# EasyEDA Pro project stm32_无人机.eprj, schematic 遥控器

## Sheets
1 MCU: Board Name: Board2; Create Date: 2025-11-27; Page Name: MCU; Project Name: stm32_无人机; Schematic Name: 遥控器; Update Date: 2025-11-27; Company: 嘉立创EDA; Page Size: A4; Version: V1.0
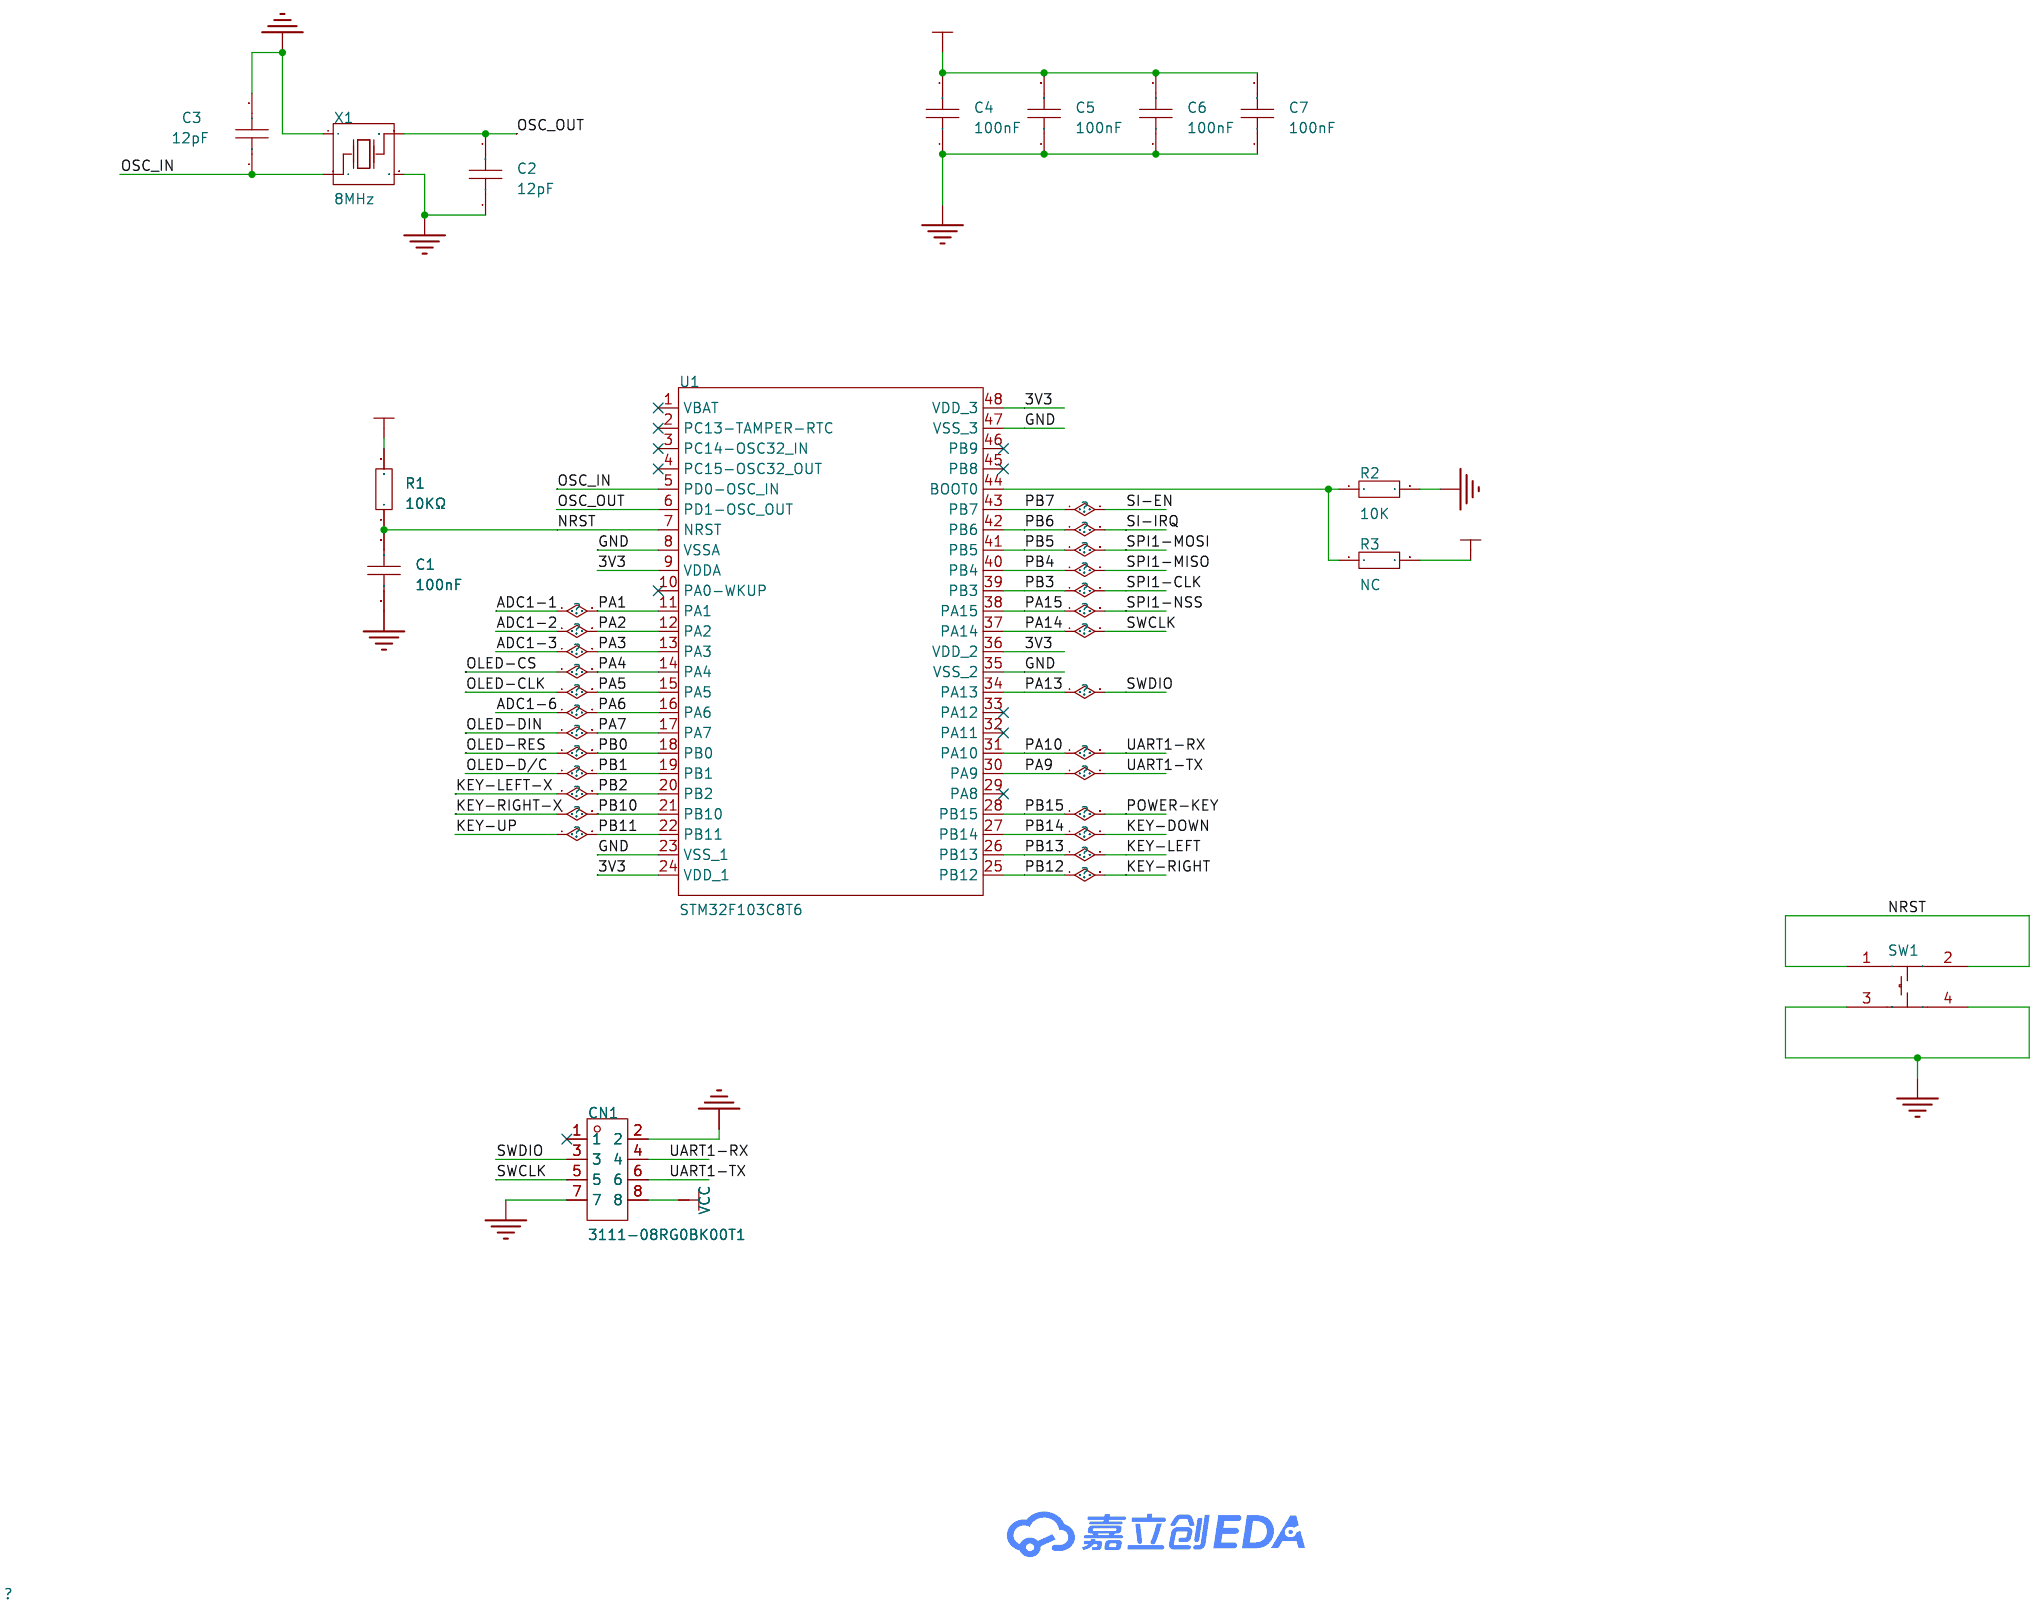
[diagram p6: MCU]
2 电源充电管理: Page Name: 电源充电管理
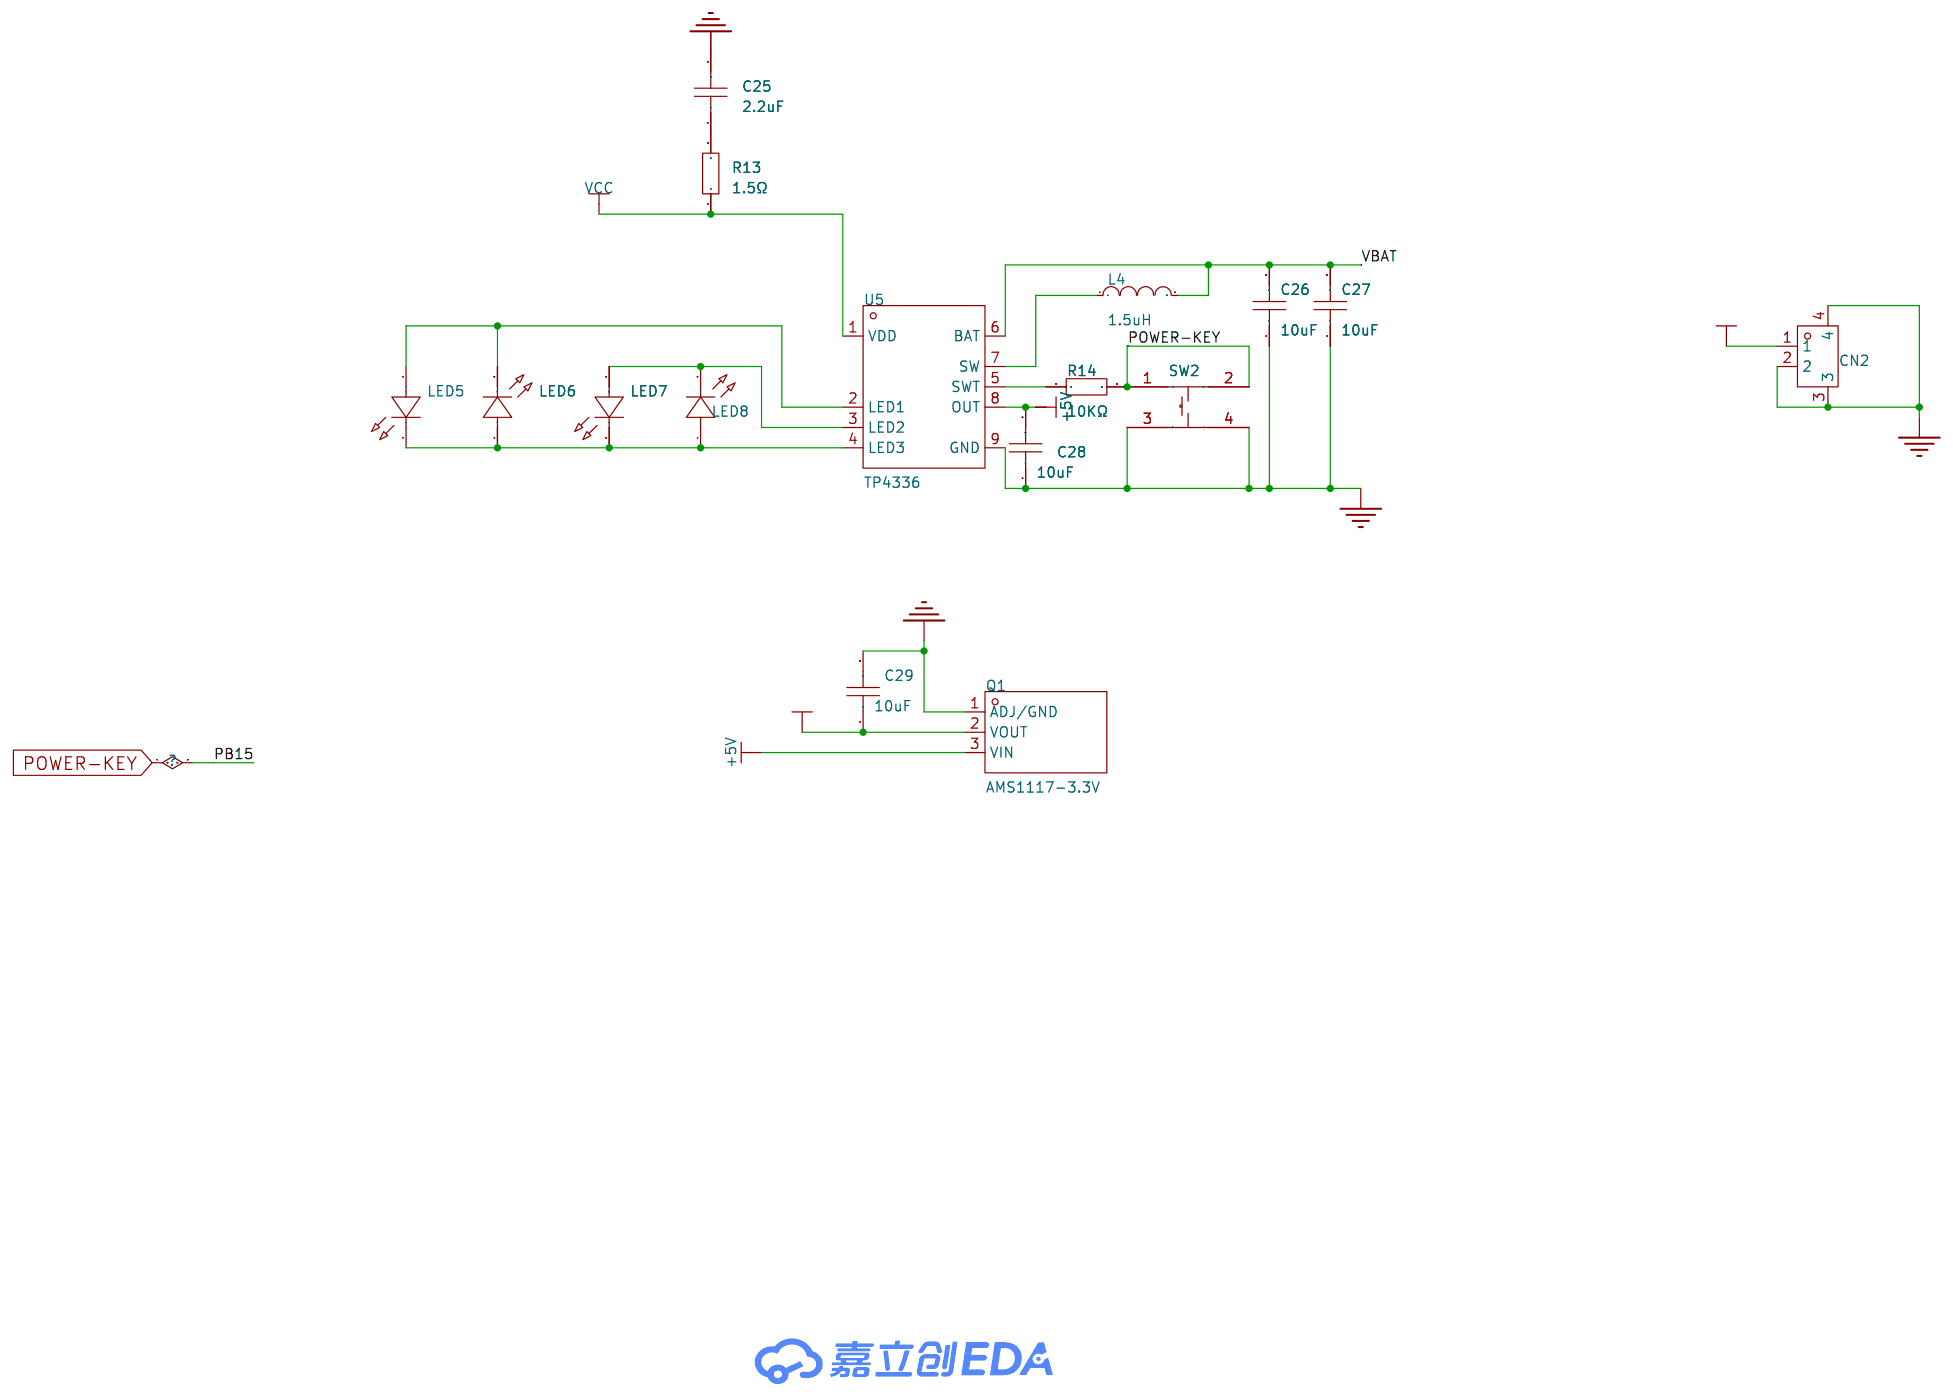
[diagram p7: 电源充电管理]
3 SI24R1: Page Name: SI24R1
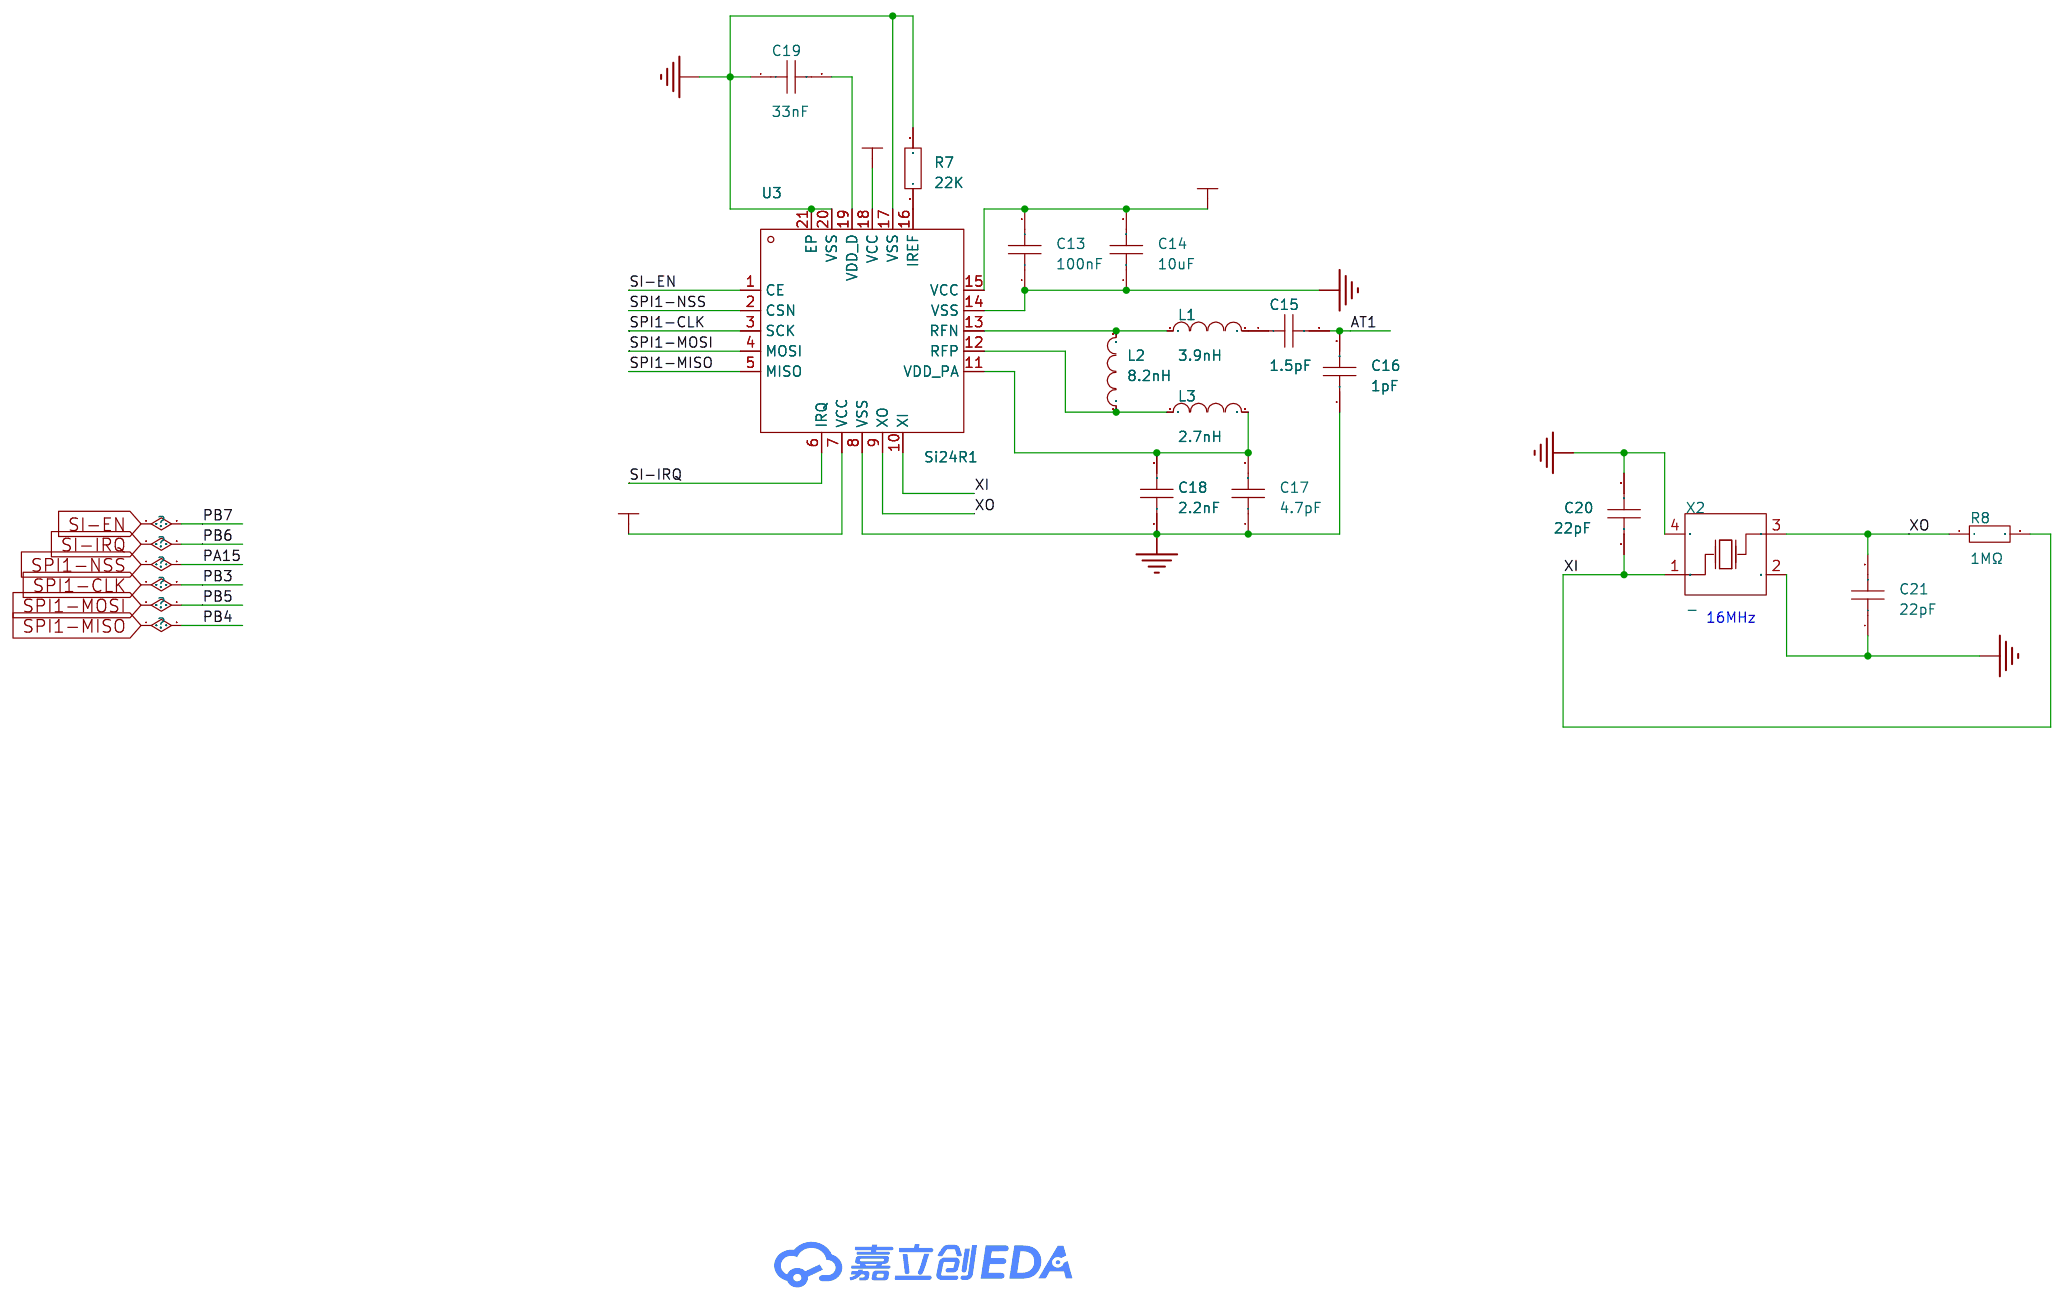
[diagram p8: SI24R1]
4 OLED: Page Name: OLED
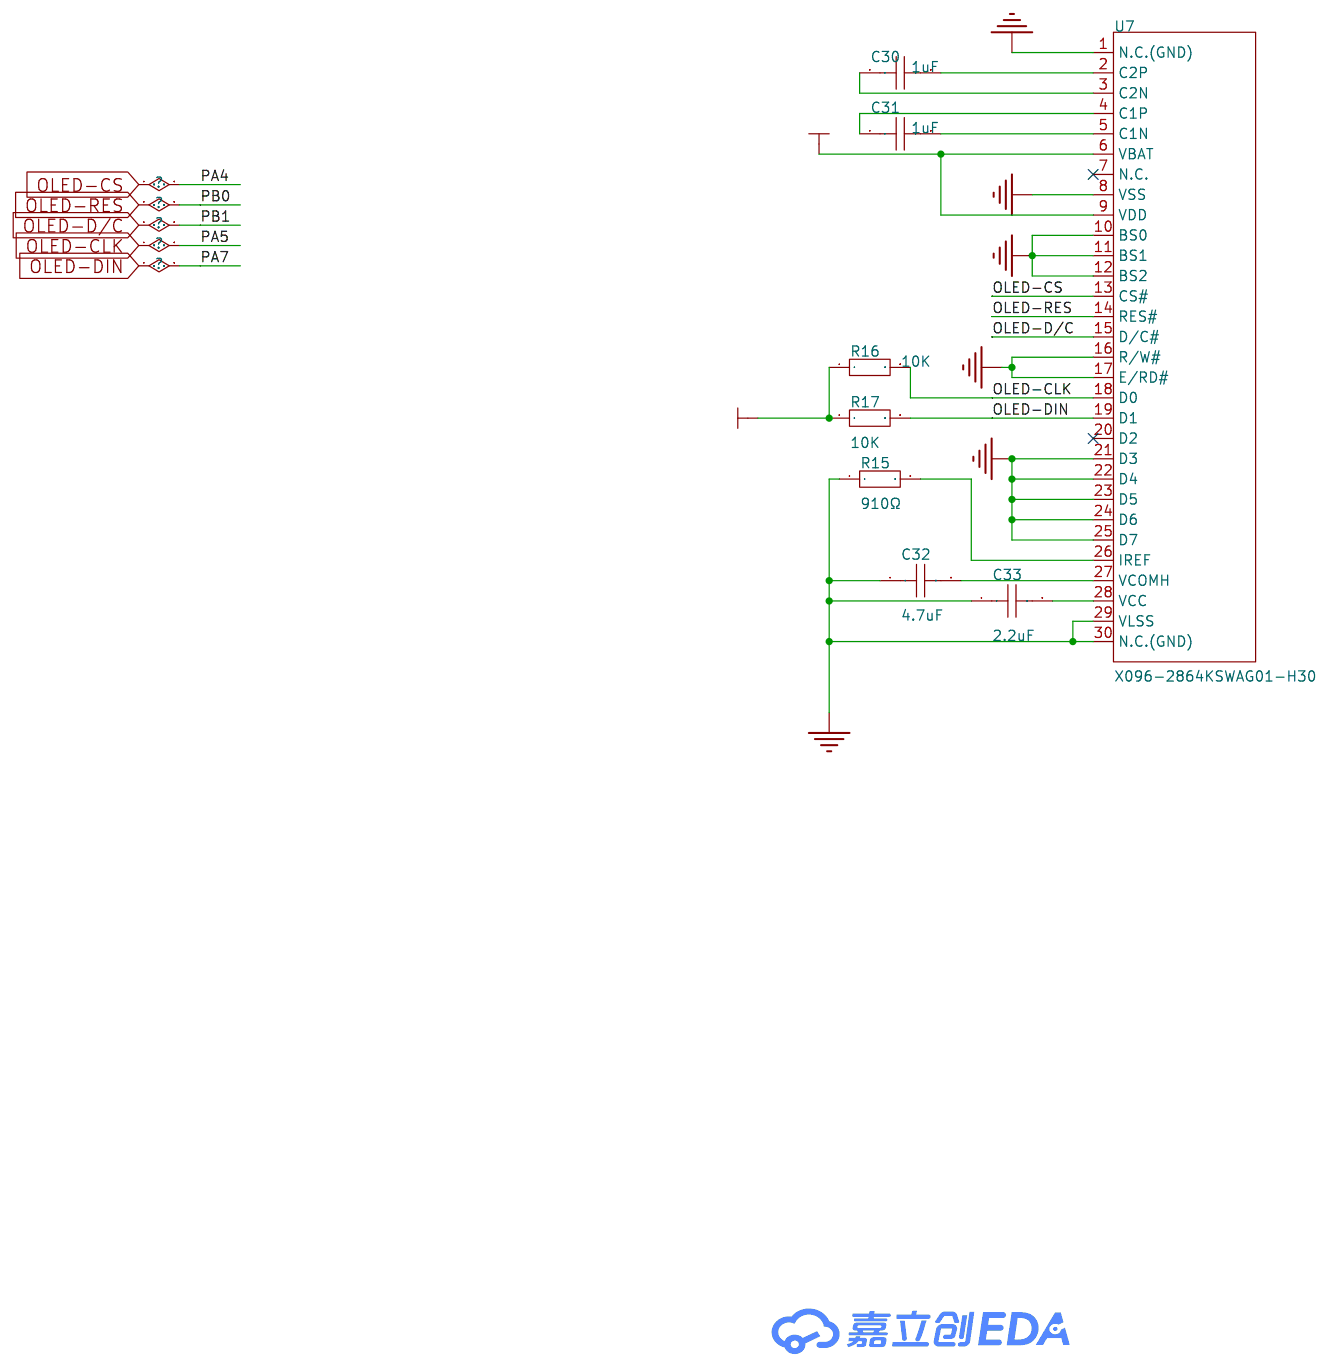
[diagram p9: OLED]
5 摇杆和按键: Page Name: 摇杆和按键
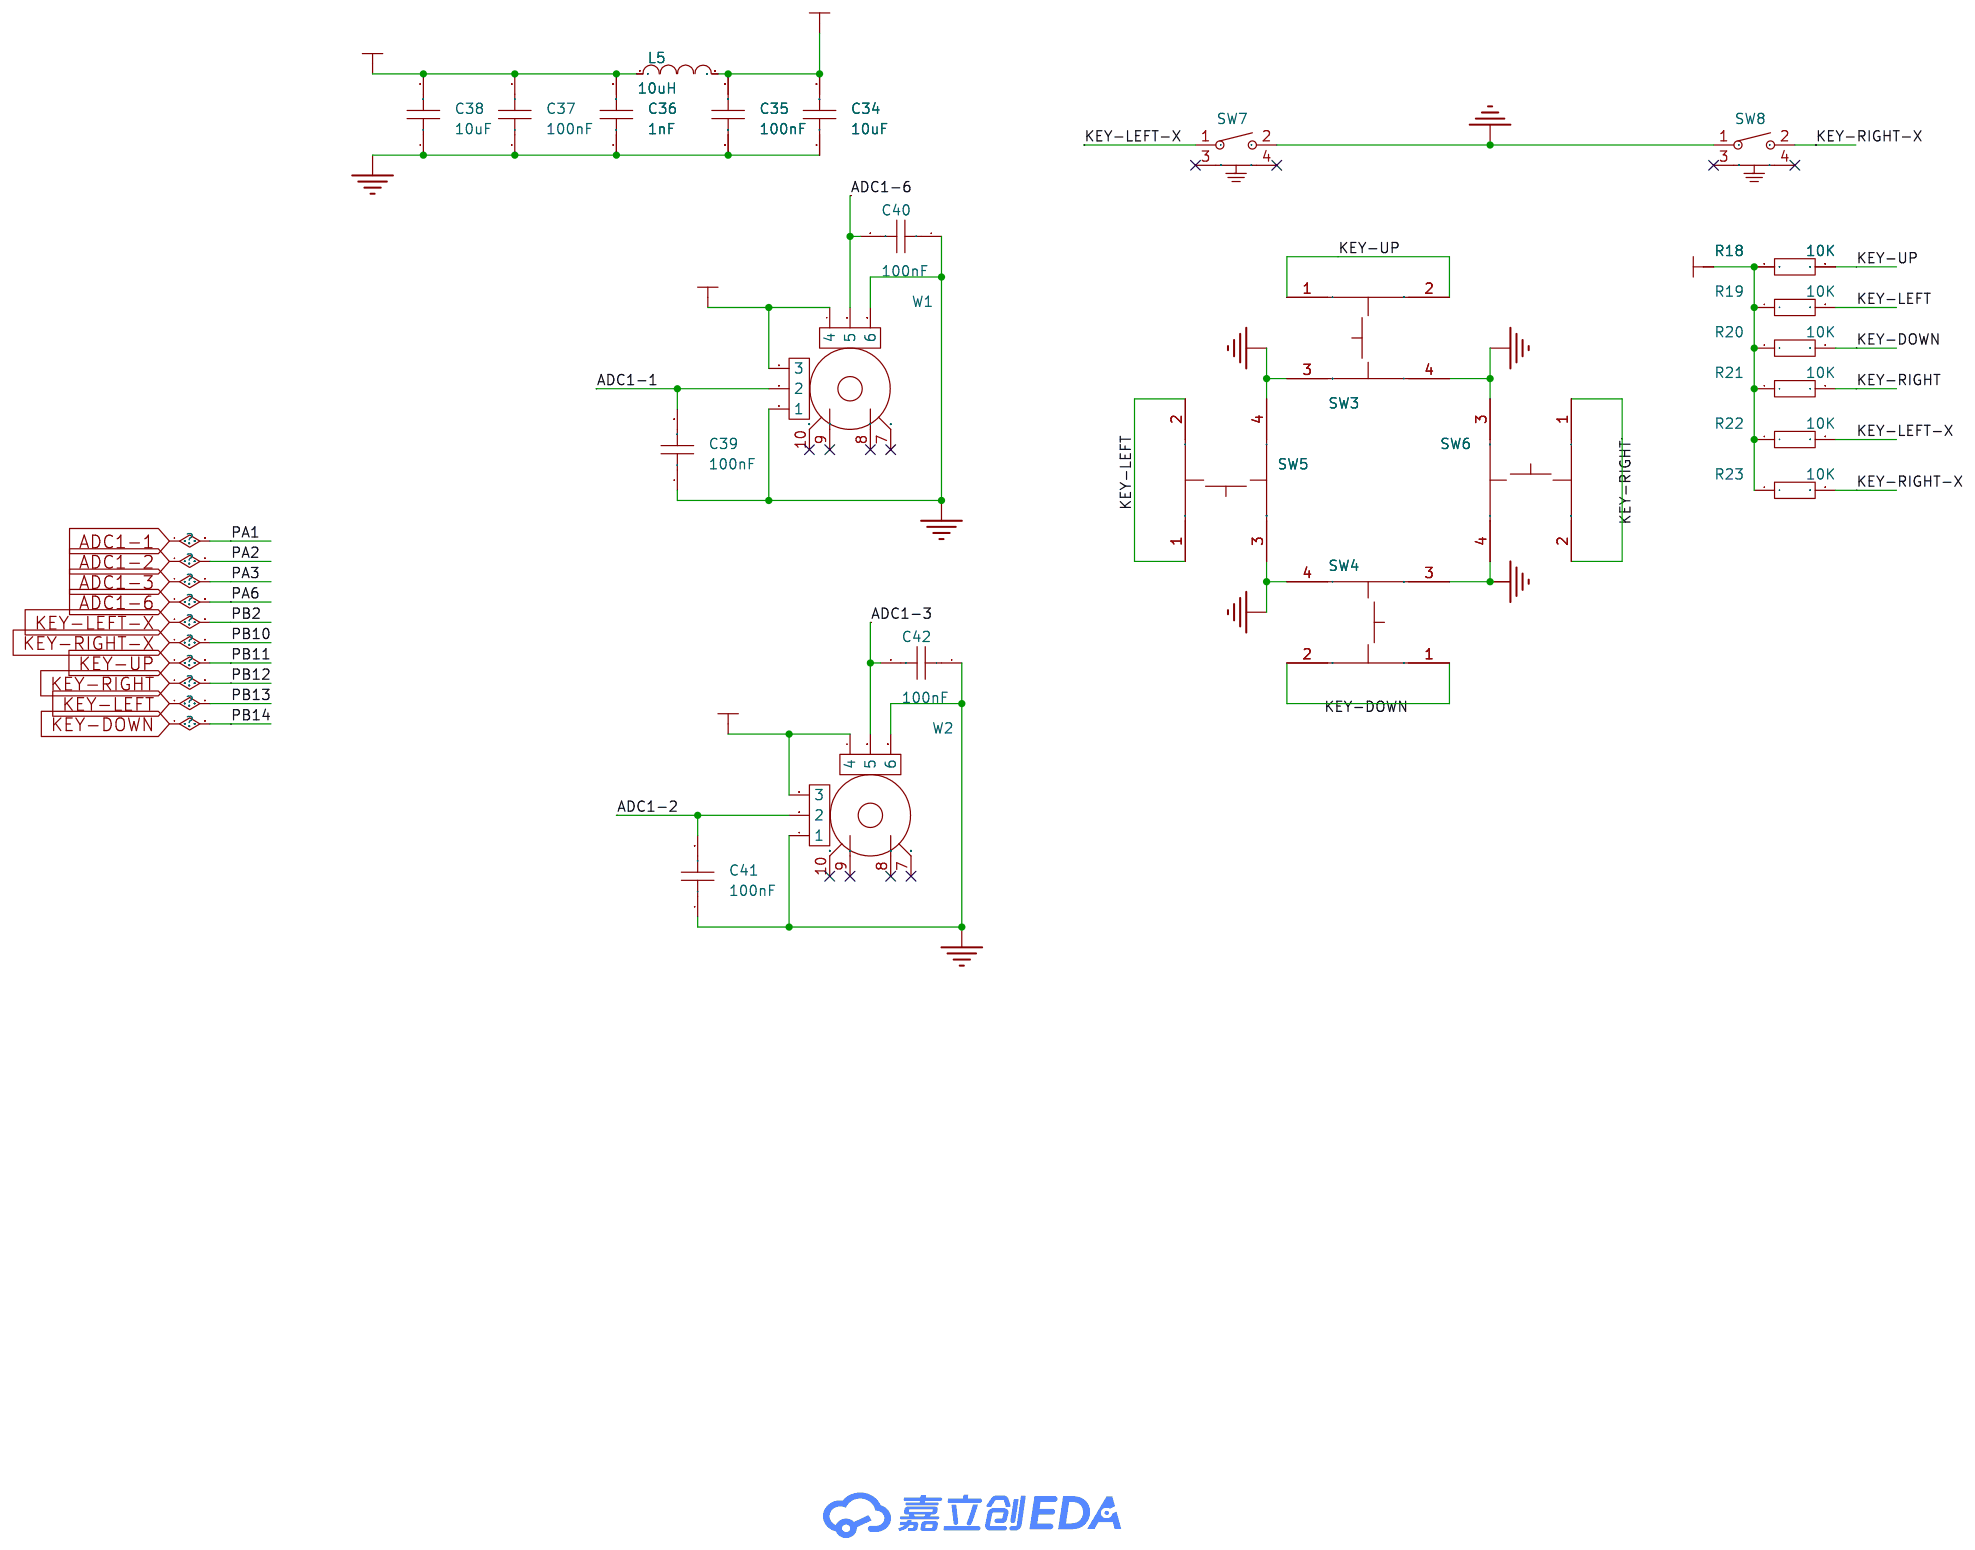
[diagram p10: 摇杆和按键]

## Parts
sheet MCU
C1  100nF  [C0603]
C2  12pF  [C0603]
C3  12pF  [C0603]
C4  100nF  [C0603]
C5  100nF  [C0603]
C6  100nF  [C0603]
C7  100nF  [C0603]
CN1  3111-08RG0BK00T1  [CONN-TH_3111-08RG0BK00T1]
R1  10KΩ  [R0603]
R2  10K  [R0603]
R3  NC  [R0603]
SW1  SKRPACE010  [KEY-SMD_4P-L4.2-W3.2-P2.20-LS4.6]
U1  STM32F103C8T6  [LQFP-48_L7.0-W7.0-P0.50-LS9.0-BL]
X1  8MHz  [CRYSTAL-SMD_4P-L3.2-W2.5-BL]
sheet OLED
C30  1uF  [C0603]
C31  1uF  [C0603]
C32  4.7uF  [C0603]
C33  2.2uF  [C0603]
R15  910Ω  [R0603]
R16  10K  [R0603]
R17  10K  [R0603]
U7  X096-2864KSWAG01-H30  [LCD-SMD_X096-2864KSWAG01-H30]
sheet SI24R1
C13  100nF  [C0603]
C14  10uF  [C0603]
C15  1.5pF  [C0603]
C16  1pF  [C0603]
C17  4.7pF  [C0603]
C18  2.2nF  [C0603]
C19  33nF  [C0603]
C20  22pF  [C0603]
C21  22pF  [C0603]
L1  3.9nH  [L0603]
L2  8.2nH  [L0603]
L3  2.7nH  [L0603]
R7  22K  [R0603]
R8  1MΩ  [R0603]
U3  Si24R1  [QFN-20_L4.0-W4.0-P0.50-BL-EP]
X2  -  [CRYSTAL-SMD_4P-L2.5-W2.0-BL-2]
sheet 摇杆和按键
C34  10uF  [C0603]
C35  100nF  [C0603]
C36  1nF  [C0603]
C37  100nF  [C0603]
C38  10uF  [C0603]
C39  100nF  [C0603]
C40  100nF  [C0603]
C41  100nF  [C0603]
C42  100nF  [C0603]
L5  10uH  [L0603]
R18  10K  [R0603]
R19  10K  [R0603]
R20  10K  [R0603]
R21  10K  [R0603]
R22  10K  [R0603]
R23  10K  [R0603]
SW3  TS-1102S-C-M-B  [KEY-SMD_4P-L6.0-W6.0-P4.50-LS8.6_TS-1102S-C-M-B]
SW4  TS-1102S-C-M-B  [KEY-SMD_4P-L6.0-W6.0-P4.50-LS8.6_TS-1102S-C-M-B]
SW5  TS-1102S-C-M-B  [KEY-SMD_4P-L6.0-W6.0-P4.50-LS8.6_TS-1102S-C-M-B]
SW6  TS-1102S-C-M-B  [KEY-SMD_4P-L6.0-W6.0-P4.50-LS8.6_TS-1102S-C-M-B]
SW7  UK-B02124G90-AQ25Y  [SW-TH_UK-B02124G90-AQ25Y]
SW8  UK-B02124G90-AQ25Y  [SW-TH_UK-B02124G90-AQ25Y]
W1  -  [16*16双路]
W2  -  [16*16双路]
sheet 电源充电管理
C25  2.2uF  [C0603]
C26  10uF  [C0603]
C27  10uF  [C0603]
C28  10uF  [C0603]
C29  10uF  [C0603]
CN2  ZX-XH2.54-2PWT  [CONN-SMD_2P-P2.54_MEGASTAR_ZX-XH2.54-2PWT]
L4  1.5uH  [L0603]
LED5  XL-1005UYC  [LED0402-FD_YELLOW]
LED6  XL-1005UYC  [LED0402-FD_YELLOW]
LED7  XL-1005UYC  [LED0402-FD_YELLOW]
LED8  XL-1005UYC  [LED0402-FD_YELLOW]
Q1  AMS1117-3.3V  [SOT-89-3_L4.5-W2.5-P1.50-LS4.2-BR]
R13  1.5Ω  [R0603]
R14  10KΩ  [R0603]
SW2  SKRPACE010  [KEY-SMD_4P-L4.2-W3.2-P2.20-LS4.6]
U5  TP4336  [ESOP-8_L4.9-W3.9-P1.27-LS6.0-BL-EP-1]

## Library data of the parts
C1-C7 C13-C21 C25-C42 = CAP_0603: Supplier Footprint: 0603
CN1 = 3111-08RG0BK00T1: LCSC Part Name: 2mm 2x4P 排数:2 每排P数:4; Supplier Part: C720751; Manufacturer: Wcon(维峰电子); Supplier Footprint: 弯插,P=2mm; JLCPCB Part Class: 扩展库; Datasheet: https://atta.szlcsc.com/upload/public/pdf/source/20200908/C720751_429ECEF3D5B5C4289EC4F86089830CA0.pdf; Supplier: LCSC; Connector Type: 简牛座; Pitch: 2mm; Structure: 2x4P; Holder Type: 弯插; Row Spacing: 2mm; Number of Rows: 2; Pin Number in each Row: 4; Contact Material: 黄铜; Contact Plating: 金
R1-R3 R7 R8 R13-R23 = Res_0603: Supplier Footprint: 0603
SW1 SW2 = SKRPACE010: LCSC Part Name: 4.2*3.2*2.5mm 立贴 轻触开关; Supplier Part: C139797; Manufacturer: ALPSALPINE(阿尔卑斯阿尔派); Supplier Footprint: SMD-4P,4.2x3.2mm; JLCPCB Part Class: 扩展库; Datasheet: https://item.szlcsc.com/datasheet/SKRPACE010/151122.html; Supplier: LCSC; Circuit: 单刀单掷; Actuator Style: 椭圆形按钮; Mounting Type: 立贴; Length: 4.2mm; Width: 3.2mm; Switch Height: 2.5mm; Contact Current: 50mA; Voltage Rating: 16V
U1 = STM32F103C8T6: LCSC Part Name: 主流增强型ARM Cortex-M3 MCU，具有64 KB Flash、72 MHz CPU、电机控制、USB和CAN; Supplier Part: C8734; Manufacturer: ST(意法半导体); Supplier Footprint: LQFP-48(7x7); JLCPCB Part Class: 扩展库; Datasheet: https://item.szlcsc.com/datasheet/STM32F103C8T6/9243.html; Supplier: LCSC; CPU Core: ARM-M3; CPU Maximum Speed: 72MHz; Program Storage Size: 64KB; Program Memory Type: FLASH; Number of I/O: 37; ADC (Bit): 12bit; Voltage - Supply: 2V~3.6V
X1 = TAXM8M4RDBCCT2T: LCSC Part Name: 8MHz ±10ppm 10pF; Supplier Part: C400090; Manufacturer: YJX(雅晶鑫); Supplier Footprint: SMD3225-4P; JLCPCB Part Class: 扩展库; Datasheet: https://item.szlcsc.com/datasheet/TAXM8M4RDBCCT2T/383475.html; Supplier: LCSC; Type: 贴片晶振; Normal temperature Frequency Tolerance: ±10ppm; Load Capacitance: 10pF; Frequency Stability: ±15ppm; Equivalent Series Resistance(ESR): 250Ω; Operating Temperature: -40℃~+85℃
U7 = X096-2864KSWAG01-H30: LCSC Part Name: 0.96寸 白光 128x64像素分辨率 30PIN; Supplier Part: C5123563; Manufacturer: Wisevision(新智景); JLCPCB Part Class: 扩展库; Datasheet: https://item.szlcsc.com/datasheet/X096-2864KSWAG01-H30/5717756.html; Supplier: LCSC; Controller Type: SSD1315; Size: 0.96; Dot Pixels: 128x64
L1-L5 = L_0603
U3 = Si24R1: LCSC Part Name: 超低功耗、高性能2.4 GHz GFSK收发器; Supplier Part: C14436; Manufacturer: 南京中科微; Supplier Footprint: QFN-20-EP(4x4); JLCPCB Part Class: 扩展库; Datasheet: https://item.szlcsc.com/datasheet/Si24R1/15098.html; Supplier: LCSC; Frequency Range: 2.4GHz~2.525GHz; Interface: SPI; Voltage - Supply: 1.9V~3.6V; Applications: ISM; Output Power: 7dBm; Data Rate: 2Mbps; Current Of Transmitting: 12mA; Sensitivity: -96dBm; Receive Current: 15mA; Typical Application Frequency: 2.4GHz; Operating Temperature: -40℃~+85℃; Type: 收发器
X2 = SX25Y016000B91T: LCSC Part Name: 2520 16M 9PF  10ppm  -20 -75℃; Supplier Part: C271644; Manufacturer: TKD(泰晶); Supplier Footprint: SMD2520-4P; JLCPCB Part Class: 扩展库; Datasheet: https://item.szlcsc.com/datasheet/SX25Y016000B91T/260707.html; Supplier: LCSC
SW3-SW6 = TS-1102S-C-M-B: LCSC Part Name: 6*6*10mm 立贴 轻触开关; Supplier Part: C381050; Manufacturer: XKB Connection(中国星坤); Supplier Footprint: SMD-4P,6x6mm; JLCPCB Part Class: 扩展库; Datasheet: https://item.szlcsc.com/datasheet/TS-1102S-C-M-B/353282.html; Supplier: LCSC; Circuit: 单刀单掷; Actuator Style: 圆形按钮; Operating Force: 2.6N; Mounting Type: 立贴; Length: 6mm; Width: 6mm; Switch Height: 10mm; with Bracket: 不带支架; Contact Current: 50mA; Voltage Rating: 12V; Actuator/Cap Color: 黑色; With Lamp: 无; Life: 30万次; Operating Temperature: -20℃~+70℃
SW7 SW8 = UK-B02124G90-AQ25Y: LCSC Part Name: 6*6*9mm 卧插 轻触开关; Supplier Part: C493238; Manufacturer: USAKRO(美韩); Supplier Footprint: 弯插,6x6mm; JLCPCB Part Class: 扩展库; Datasheet: https://item.szlcsc.com/datasheet/UK-B02124G90-AQ25Y/503894.html; Supplier: LCSC; Circuit: 单刀单掷; Actuator Style: 圆形按钮; Operating Force: 2.5N; Mounting Type: 弯插; Length: 6mm; Width: 6mm; Switch Height: 9mm; with Bracket: 带支架; Contact Current: 50mA; Voltage Rating: 12V; Actuator/Cap Color: 黑色; With Lamp: 无; Termination Style: PC引脚; Life: 10万次; Operating Temperature: -20℃~+70℃
W1 W2 = 双路摇杆
CN2 = ZX-XH2.54-2PWT: LCSC Part Name: 1x2P 间距:2.5mm 卧贴 系列:XH; Supplier Part: C7429671; Manufacturer: Megastar(兆星); Supplier Footprint: SMD,P=2.5mm,卧贴; JLCPCB Part Class: 扩展库; Datasheet: https://item.szlcsc.com/datasheet/ZX-XH2.54-2PWT/8427588.html; Supplier: LCSC; Pins Structure: 1x2P; Pitch: 2.5mm; Mounting Type: 卧贴; Reference Series: XH; Number of Pins: 2P; Number of Rows: 1; Number of PINs Per Row: 2; Current Rating: 3A; Contact Material: 黄铜; Contact Plating: 锡; Operating Temperature: -25℃~+85℃; Voltage Rating: 250V; Plastic Material: LCP; Supplementary Features: 辅助焊脚; Color: 米色; Z-Height of the Board: 6.2mm; X-Length of Bottom Edge on Board (Spacing Line): 10mm; Y-Width of Bottom Edge on Board: 7.8mm
LED5-LED8 = XL-1005UYC_C25503856: LCSC Part Name: 0402黄光贴片式发光二极管; Supplier Part: C25503856; Manufacturer: XINGLIGHT(成兴光); Supplier Footprint: 0402; JLCPCB Part Class: 扩展库; Datasheet: https://item.szlcsc.com/datasheet/XL-1005UYC/27234970.html; Supplier: LCSC; Illumination Color: 黄色; Voltage - Forward(Vf): 2.4V; Power(Watts): 50mW; Forward Current: 20mA; Wavelength - Dominant: 585nm~595nm; Peak Wavelength: 590nm; Luminous Intensity: 210mcd; Viewing Angle: 120°; Operating Temperature: -40℃~+85℃
Q1 = AMS1117-3.3V_C5120796: LCSC Part Name: 输入18V 输出3.3V 1A; Supplier Part: C5120796; Manufacturer: MSKSEMI(美森科); Supplier Footprint: SOT-89; JLCPCB Part Class: 扩展库; Datasheet: https://item.szlcsc.com/datasheet/AMS1117-3.3V/5706251.html; Supplier: LCSC; Output Type: 固定; Voltage - Supply: 18V; Output Voltage: 3.3V; Output Current: 1A; Voltage Dropout: 1.4V@(1A); standby current: 12mA; Operating Temperature: 0℃~+125℃; Output Configuration: 正极; Number of Outputs: 1
U5 = TP4336: Supplier Part: C29075510; Manufacturer: TPOWER(天源); Supplier Footprint: ESOP-8L; JLCPCB Part Class: 扩展库; Datasheet: https://item.szlcsc.com/datasheet/TP4336/30801980.html; Supplier: LCSC

## Nets
3V3: C4.2 C5.2 C6.2 C7.2 C13.2 C14.2 C29.1 C34.2 C35.2 L5.2 Q1.2(VOUT) R1.2 R3.2 R16.1 R17.1 R18.1 R19.1 R20.1 R21.1 R22.1 R23.1 U1.9(VDDA) U1.24(VDD_1) U1.36(VDD_2) U1.48(VDD_3) U3.7(VCC) U3.15(VCC) U3.18(VCC) U7.6(VBAT) U7.9(VDD)
3V3A: C36.2 C37.2 C38.2 L5.1 W1.3 W1.4 W2.3 W2.4
+5V: C28.2 Q1.3(VIN) U5.8(OUT)
GND: C1.1 C2.1 C3.2 C4.1 C5.1 C6.1 C7.1 C13.1 C14.1 C16.1 C17.1 C18.1 C19.1 C20.2 C21.1 C25.2 C26.1 C27.1 C28.1 C29.2 C32.1 C33.1 C34.1 C35.1 C36.1 C37.1 C38.1 C39.1 C40.1 C41.1 C42.1 CN1.2 CN1.7 CN2.2 CN2.3 CN2.4 Q1.1(ADJ/GND) R2.2 R7.2 R15.1 SW1.3 SW1.4 SW2.3 SW2.4 SW3.3 SW3.4 SW4.3 SW4.4 SW5.3 SW5.4 SW6.3 SW6.4 SW7.2 SW8.1 U1.8(VSSA) U1.23(VSS_1) U1.35(VSS_2) U1.47(VSS_3) U3.8(VSS) U3.14(VSS) U3.17(VSS) U3.20(VSS) U3.21(EP) U5.9(GND) U7.1(N.C.(GND)) U7.8(VSS) U7.10(BS0) U7.11(BS1) U7.12(BS2) U7.16(R/W#) U7.17(E/RD#) U7.21(D3) U7.22(D4) U7.23(D5) U7.24(D6) U7.25(D7) U7.29(VLSS) U7.30(N.C.(GND)) W1.1 W1.6 W2.1 W2.6 X1.2 X1.4 X2.2(GND) X2.4(GND)
VBAT: C26.2 C27.2 CN2.1 L4.2 U5.6(BAT)
VCC: CN1.8 R13.1 U5.1(VDD)
ADC1-1: C39.2 U1.11(PA1) W1.2
ADC1-2: C41.2 U1.12(PA2) W2.2
ADC1-3: C42.2 U1.13(PA3) W2.5
ADC1-6: C40.2 U1.16(PA6) W1.5
AT1: C15.2 C16.2
KEY-DOWN: R20.2 SW4.1 SW4.2 U1.27(PB14)
KEY-LEFT: R19.2 SW5.1 SW5.2 U1.26(PB13)
KEY-LEFT-X: R22.2 SW7.1 U1.20(PB2)
KEY-RIGHT: R21.2 SW6.1 SW6.2 U1.25(PB12)
KEY-RIGHT-X: R23.2 SW8.2 U1.21(PB10)
KEY-UP: R18.2 SW3.1 SW3.2 U1.22(PB11)
NRST: C1.2 R1.1 SW1.1 SW1.2 U1.7(NRST)
OLED-CLK: R16.2 U1.15(PA5) U7.18(D0)
OLED-CS: U1.14(PA4) U7.13(CS#)
OLED-D/C: U1.19(PB1) U7.15(D/C#)
OLED-DIN: R17.2 U1.17(PA7) U7.19(D1)
OLED-RES: U1.18(PB0) U7.14(RES#)
OSC_IN: C3.1 U1.5(PD0-OSC_IN) X1.1
OSC_OUT: C2.2 U1.6(PD1-OSC_OUT) X1.3
PA9: CN1.6 U1.30(PA9)
PA10: CN1.4 U1.31(PA10)
PA13: CN1.3 U1.34(PA13)
PA14: CN1.5 U1.37(PA14)
PA15: U1.38(PA15) U3.2(CSN)
PB3: U1.39(PB3) U3.3(SCK)
PB4: U1.40(PB4) U3.5(MISO)
PB5: U1.41(PB5) U3.4(MOSI)
PB6: U1.42(PB6) U3.6(IRQ)
PB7: U1.43(PB7) U3.1(CE)
PB15: R14.2 SW2.1 SW2.2 U1.28(PB15)
XI: C20.1 R8.2 U3.10(XI) X2.1(OSC1)
XO: C21.2 R8.1 U3.9(XO) X2.3(OSC2)
$2N785: L4.1 U5.7(SW)
$2N788: R14.1 U5.5(SWT)
$2N793: LED5.2(K) LED6.1(A) LED7.2(K) LED8.1(A) U5.4(LED3)
$2N794: LED7.1(A) LED8.2(K) U5.3(LED2)
$2N795: LED5.1(A) LED6.2(K) U5.2(LED1)
$2N798: C25.1 R13.2
$3N853: L2.1 L3.1 U3.12(RFP)
$3N854: C17.2 C18.2 L3.2 U3.11(VDD_PA)
$3N855: L1.1 L2.2 U3.13(RFN)
$3N877: R7.1 U3.16(IREF)
$3N878: C19.2 U3.19(VDD_D)
$3N883: C15.1 L1.2
$4N420: C30.2 U7.2(C2P)
$4N424: C30.1 U7.3(C2N)
$4N430: C31.1 U7.4(C1P)
$4N436: C31.2 U7.5(C1N)
$4N747: R15.2 U7.26(IREF)
$4N851: C32.2 U7.27(VCOMH)
$4N925: C33.2 U7.28(VCC)
Net-(R2-1): R2.1 R3.1 U1.44(BOOT0)

Not connected (* = marked no-connect by the designer): CN1 1*; SW7 3(EP)* 4(EP)*; SW8 3(EP)* 4(EP)*; U1 1(VBAT)* 2(PC13-TAMPER-RTC)* 3(PC14-OSC32_IN)* 4(PC15-OSC32_OUT)* 10(PA0-WKUP)* 29(PA8)* 32(PA11)* 33(PA12)* 45(PB8)* 46(PB9)*; U7 7(N.C.)* 20(D2)*; W1 7(GND)* 8(GND)* 9(GND)* 10(GND)*; W2 7(GND)* 8(GND)* 9(GND)* 10(GND)*

## Notes on the sheets
sheet 3
- 16MHz
